# EAGLE board BluePLC B1 MEGA128 -00 (EAGLE 5.03), part 1 of 2
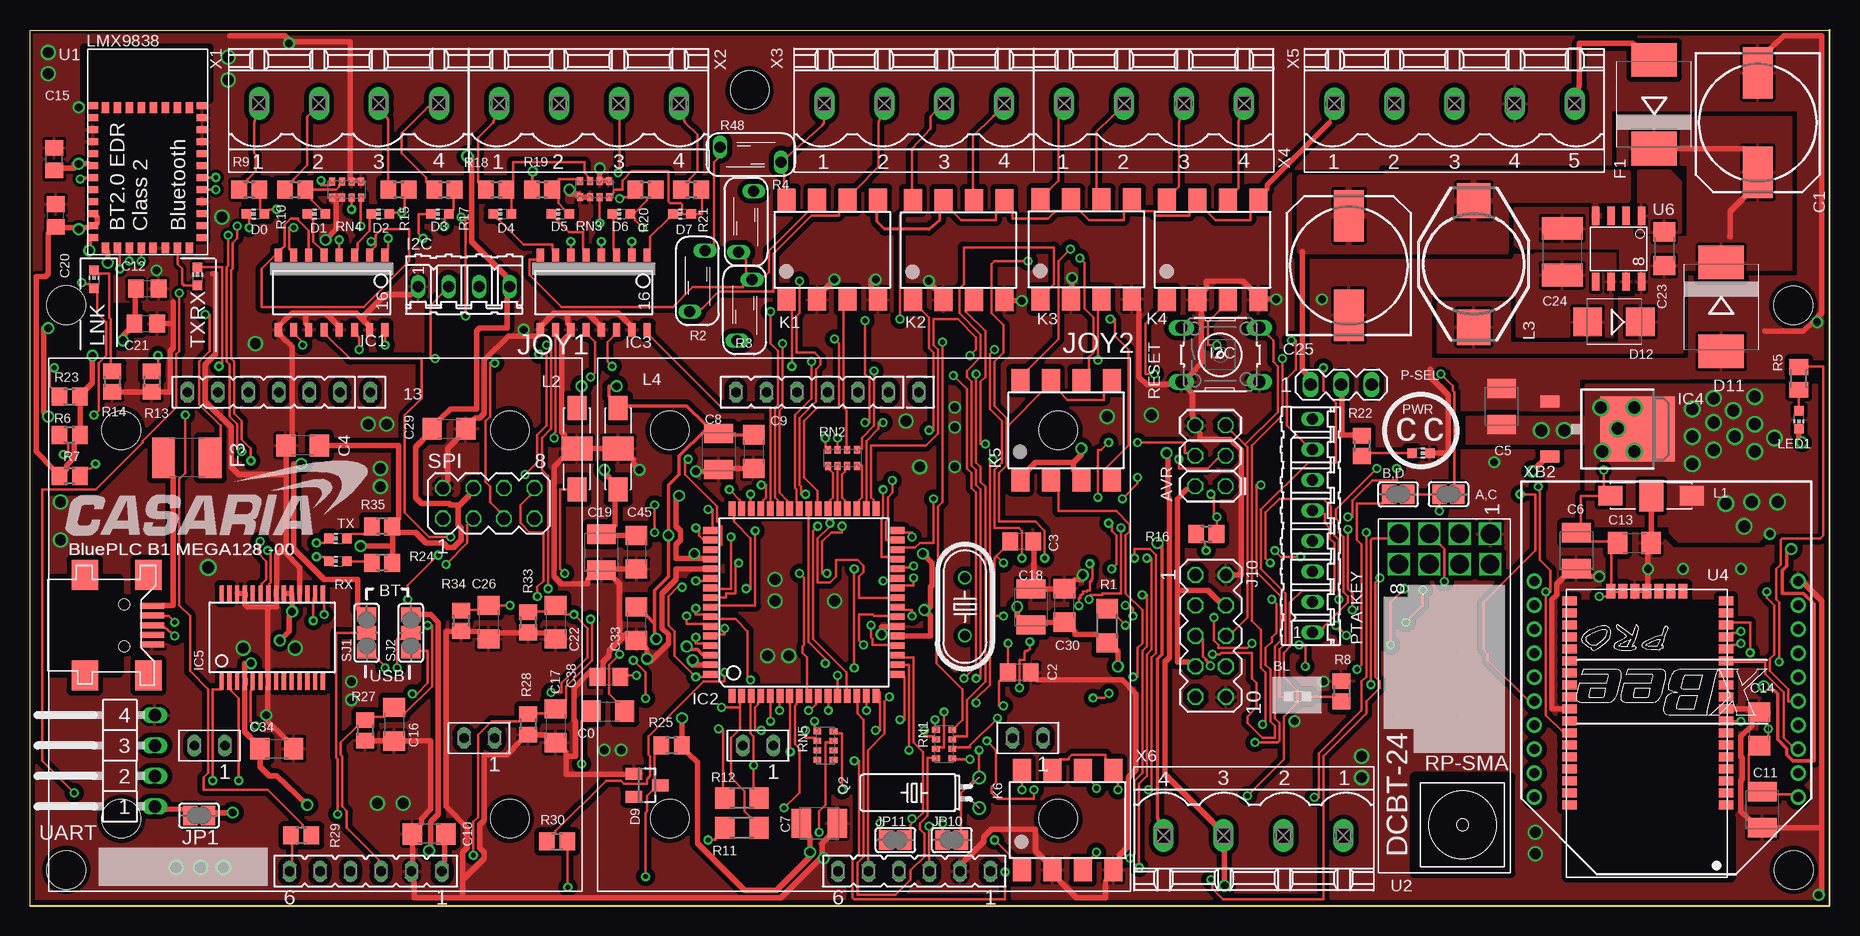
[diagram p4: board, top side]
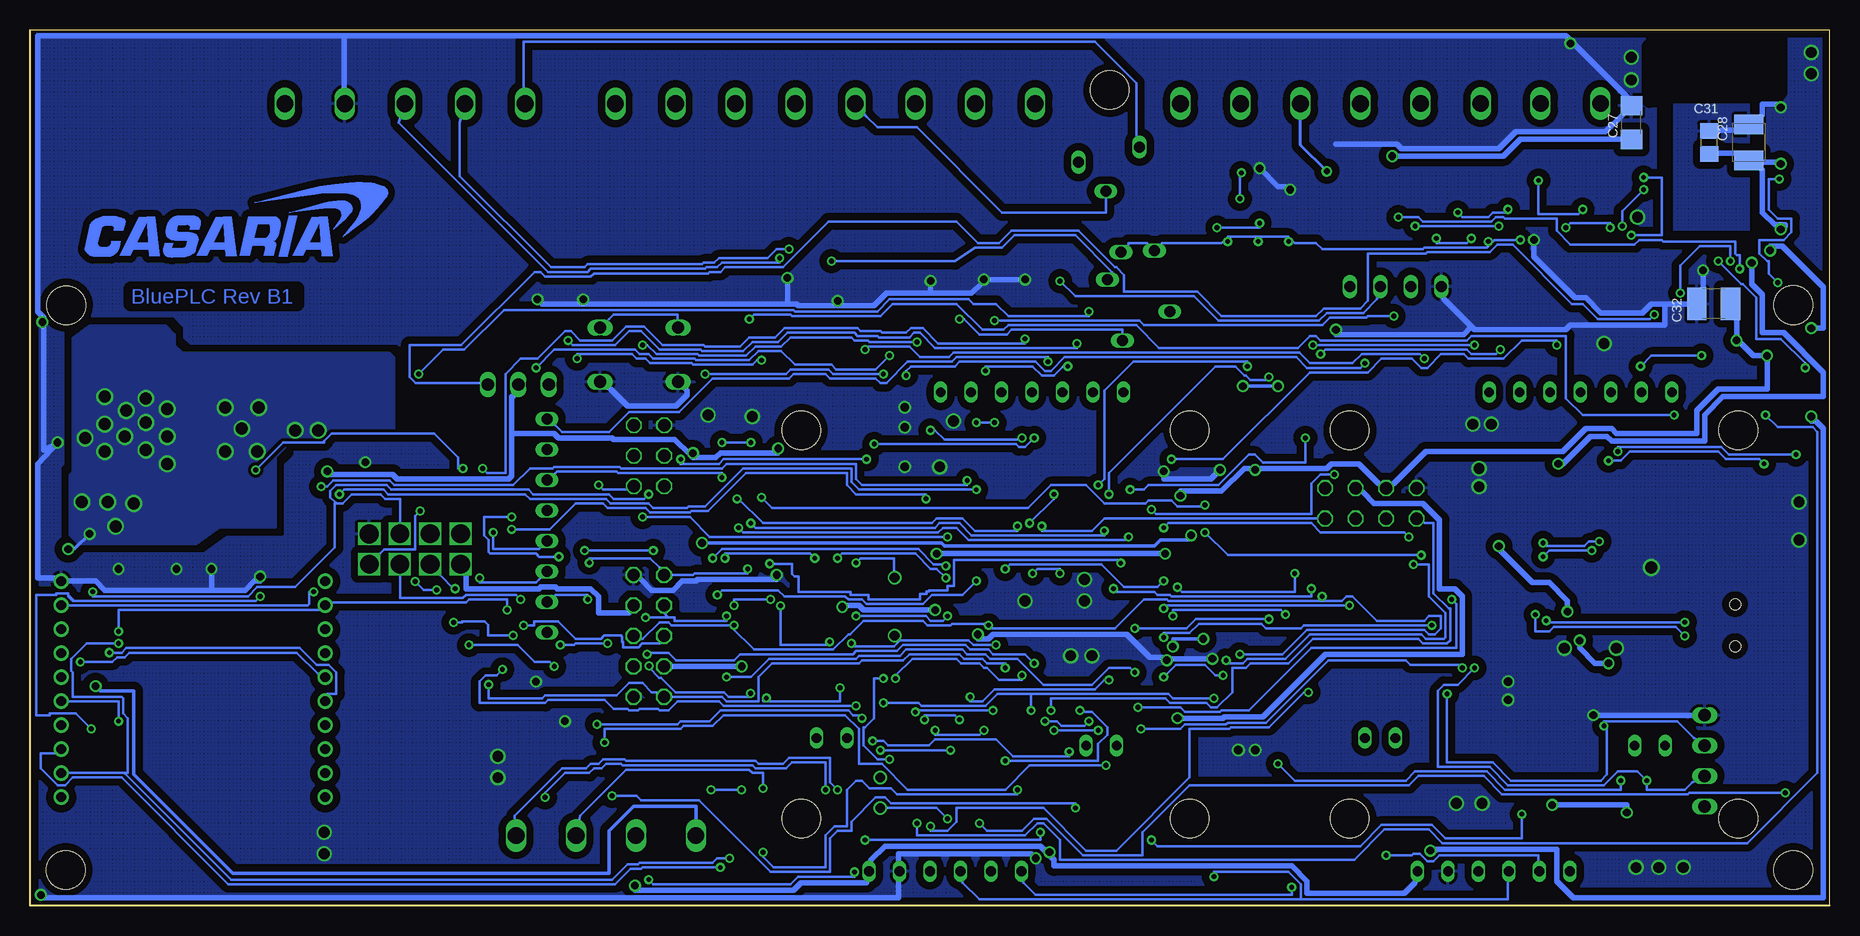
[diagram p5: board, bottom side, seen from below]

Size 150 x 73 mm. Coordinates in mm from the lower left corner, seen from the top.
Outline: 0,0 0,73 150,73 150,0 0,0
Copper layers (1*16): Top 0.035mm / dielectric 1.5mm / Bottom 0.035mm
Design rules "default *": minimum track width 7mil, minimum drill 0.4mm, track to track 7mil, track to pad 7mil, pad to pad 8mil, via to via 8mil, smd to smd 7mil, copper to edge 10mil, drill to drill 15mil, minimum pad ring 6mil, minimum via ring 7mil, stop-mask expansion 4mil, vias tented up to drill 0mil, thermal gap 10mil
Net classes: 0 default: width 0.203 mm, clearance 0.152 mm; 1 smps: width 0.305 mm, drill 0.635 mm, clearance 0.152 mm; 2 power: width 0.457 mm, drill 0.635 mm, clearance 0.152 mm; 3 gnd: width 0.457 mm, drill 0.635 mm, clearance 0.152 mm
Holes 3.2 mm at 3.02,50.07 3.02,2.97 59.98,67.99 147.02,2.97 146.98,50.04
tRestrict: area 128.1,2.4 to 141.7,25
bRestrict: area 4.2,67.6 to 14.6,72.8

## Footprints (pad centres in the part's own frame; a part is rotated, then mirrored left to right if it is on the bottom)
SJ = smd 1.168 x 1.6: 1 -0.762,0; 2 0.762,0
2X3 = drill 1.016 octagon: 1 0,0; 2 0,2.54; 3 2.54,0; 4 2.54,2.54; 5 5.08,0; 6 5.08,2.54
CHIP-LED0603 = smd 0.8 x 0.8: A 0,-0.75; C 0,0.75
C1206 = smd 1.6 x 1.8: 1 -1.4,0; 2 1.4,0
150CLZ-1010 = smd 4.3 x 2.5: + 4.15,0; - -4.15,0
C0805 = smd 1.3 x 1.5: 1 -0.95,0; 2 0.95,0
SMC_B = smd 1.6 x 2.4: + -1.5,0; - 1.5,0
C1812 = smd 1.9 x 3.4: 1 -1.95,0; 2 1.95,0
C1210 = smd 1.6 x 2.7: 1 -1.4,0; 2 1.4,0
SOT23 = smd 1 x 1.4: 1 -0.95,-1.1; 2 0.95,-1.1; 3 0,1.1
SMC = smd 2.8 x 3.8: A 3.7,0; C -3.7,0
SMB = smd 2.4 x 2.4: A 2.2,0; C -2.2,0
04P = drill 0.914 long: 1 -3.81,0; 2 -1.27,0; 3 1.27,0; 4 3.81,0
SO16-OC = smd 0.6 x 1.1: 1 -4.445,-3.175; 2 -3.175,-3.175; 3 -1.905,-3.175; 4 -0.635,-3.175; 5 0.635,-3.175; 6 1.905,-3.175; 7 3.175,-3.175; 8 4.445,-3.175; 9 4.445,3.048; 10 3.175,3.048; 11 1.905,3.048; 12 0.635,3.048; 13 -0.635,3.048; 14 -1.905,3.048; 15 -3.175,3.048; 16 -4.445,3.048
TQFP64 = smd 1.194 x 0.559: 1 -7.8,6; 2 -7.8,5.2; 3 -7.8,4.4; 4 -7.8,3.6; 5 -7.8,2.8; 6 -7.8,2; 7 -7.8,1.2; 8 -7.8,0.4; 9 -7.8,-0.4; 10 -7.8,-1.2; 11 -7.8,-2; 12 -7.8,-2.8; 13 -7.8,-3.6; 14 -7.8,-4.4; 15 -7.8,-5.2; 16 -7.8,-6; 33 7.8,-6; 34 7.8,-5.2; 35 7.8,-4.4; 36 7.8,-3.6; 37 7.8,-2.8; 38 7.8,-2; 39 7.8,-1.2; 40 7.8,-0.4; 41 7.8,0.4; 42 7.8,1.2; 43 7.8,2; 44 7.8,2.8; 45 7.8,3.6; 46 7.8,4.4; 47 7.8,5.2; 48 7.8,6 | smd 0.559 x 1.194: 17 -6,-7.8; 18 -5.2,-7.8; 19 -4.4,-7.8; 20 -3.6,-7.8; 21 -2.8,-7.8; 22 -2,-7.8; 23 -1.2,-7.8; 24 -0.4,-7.8; 25 0.4,-7.8; 26 1.2,-7.8; 27 2,-7.8; 28 2.8,-7.8; 29 3.6,-7.8; 30 4.4,-7.8; 31 5.2,-7.8; 32 6,-7.8; 49 6,7.8; 50 5.2,7.8; 51 4.4,7.8; 52 3.6,7.8; 53 2.8,7.8; 54 2,7.8; 55 1.2,7.8; 56 0.4,7.8; 57 -0.4,7.8; 58 -1.2,7.8; 59 -2,7.8; 60 -2.8,7.8; 61 -3.6,7.8; 62 -4.4,7.8; 63 -5.2,7.8; 64 -6,7.8
DPACK = smd 1 x 1.6: 1 -2.28,-4.8; 3 2.28,-4.8 | smd 5.4 x 6.2: 2 0,2.5
SSOP28DB = smd 0.348 x 1.397: 1 -4.225,-3.656; 2 -3.575,-3.656; 3 -2.925,-3.656; 4 -2.275,-3.656; 5 -1.625,-3.656; 6 -0.975,-3.656; 7 -0.325,-3.656; 8 0.325,-3.656; 9 0.975,-3.656; 10 1.625,-3.656; 11 2.275,-3.656; 12 2.925,-3.656; 13 3.575,-3.656; 14 4.225,-3.656; 15 4.225,3.656; 16 3.575,3.656; 17 2.925,3.656; 18 2.275,3.656; 19 1.625,3.656; 20 0.975,3.656; 21 0.325,3.656; 22 -0.325,3.656; 23 -0.975,3.656; 24 -1.625,3.656; 25 -2.275,3.656; 26 -2.925,3.656; 27 -3.575,3.656; 28 -4.225,3.656
MA05-2 = drill 1.016 octagon: 1 -5.08,-1.27; 2 -5.08,1.27; 3 -2.54,-1.27; 4 -2.54,1.27; 5 0,-1.27; 6 0,1.27; 7 2.54,-1.27; 8 2.54,1.27; 9 5.08,-1.27; 10 5.08,1.27
CTI_JOY = drill 0.813 long: 1 10.541,-20.574; 2 8.001,-20.574; 3 5.461,-20.574; 4 2.921,-20.574; 5 0.381,-20.574; 6 -2.159,-20.574; 7 14.922,-9.461; 8 12.383,-9.461; 9 -7.556,-10.097; 10 -10.097,-10.097; 11 -10.668,19.367; 12 -8.128,19.367; 13 -5.588,19.367; 14 -3.048,19.367; 15 -0.508,19.367; 16 2.032,19.367; 17 4.572,19.367 | hole 3.2: -16.192,16.192; 16.192,16.192; 16.192,-16.192; -16.192,-16.192
DIL08SMD = smd 1.5 x 1.9: 1 -3.81,-4.15; 2 -1.27,-4.15; 3 1.27,-4.15; 4 3.81,-4.15; 5 3.81,4.15; 6 1.27,4.15; 7 -1.27,4.15; 8 -3.81,4.15
NFE61P = smd 2 x 1.6: 1 -3.4,0; 3 3.4,0 | smd 2 x 2.6: 2 0,0
DO3316P = smd 2.92 x 2.79: 1 -5.28,0; 2 5.28,0
MA03-1 = drill 1.016 long: 1 -2.54,0; 2 0,0; 3 2.54,0
08P = drill 0.914 long: 1 -8.89,0; 2 -6.35,0; 3 -3.81,0; 4 -1.27,0; 5 1.27,0; 6 3.81,0; 7 6.35,0; 8 8.89,0
HC49U-V = drill 0.813 round: 1 -2.413,0; 2 2.413,0
TC38H = drill 0.813 round: 1 -1.27,0; 2 1.27,0
R1206 = smd 1.6 x 1.803: 1 -1.422,0; 2 1.422,0
S05K11 = drill 0.914 long: 1 -0.635,-2.54; 2 0.635,2.54
M0805 = smd 1.3 x 1.6: 1 -0.95,0; 2 0.95,0
R0805 = smd 1.3 x 1.5: 1 -0.85,0; 2 0.85,0
B3F-10XX = drill 1.016 long: 1 -3.251,2.261; 2 3.251,2.261; 3 -3.251,-2.261; 4 3.251,-2.261
CAT16 = smd 0.5 x 0.65: 1 -1.2,-0.675; 2 -0.4,-0.675; 3 0.4,-0.675; 4 1.2,-0.675; 5 1.2,0.675; 6 0.4,0.675; 7 -0.4,0.675; 8 -1.2,0.675
SJ_2 = smd 1.168 x 1.6: 1 -1.524,0; 2 0,0; 3 1.524,0
MA04-2 = drill 1.016 octagon: 1 -3.81,-1.27; 2 -3.81,1.27; 3 -1.27,-1.27; 4 -1.27,1.27; 5 1.27,-1.27; 6 1.27,1.27; 7 3.81,-1.27; 8 3.81,1.27
LMX9838 = smd 0.9 x 0.6: 1 -4.55,6; 2 -4.55,5; 3 -4.55,4; 4 -4.55,3; 5 -4.55,2; 6 -4.55,1; 7 -4.55,0; 8 -4.55,-1; 9 -4.55,-2; 10 -4.55,-3; 11 -4.55,-4; 12 -4.55,-5; 21 4.55,-5; 22 4.55,-4; 23 4.55,-3; 24 4.55,-2; 25 4.55,-1; 26 4.55,0; 27 4.55,1; 28 4.55,2; 29 4.55,3; 30 4.55,4; 31 4.55,5; 32 4.55,6 | smd 0.6 x 0.9: 13 -3.5,-5.85; 14 -2.5,-5.85; 15 -1.5,-5.85; 16 -0.5,-5.85; 17 0.45,-5.85; 18 1.5,-5.85; 19 2.5,-5.85; 20 3.5,-5.85; 33 3.5,5.85; 34 2.5,5.85; 35 1.5,5.85; 36 0.5,5.85; 37 -0.5,5.85; 38 -1.5,5.85; 39 -2.5,5.85; 40 -3.5,5.85
DCB-24B-MILLMAX0295 = drill 1.575 pad 1.778 square: 1 1.23,9.31 | drill 1.549 pad 1.778 square: 2 3.77,9.31; 3 1.23,6.77; 4 3.77,6.77; 5 1.23,4.23; 6 3.77,4.23; 7 1.23,1.69; 8 3.77,1.69
ZDM-A2 = smd 0.75 x 1.2: P$1 8.55,6.6; P$2 7.55,6.6; P$3 6.55,6.6; P$4 5.55,6.6; P$5 4.55,6.6; P$6 3.55,6.6; P$7 2.55,6.6; P$8 1.55,6.6; P$9 0.55,6.6; P$10 -0.45,6.6; P$11 -1.45,6.6; P$12 -2.45,6.6; P$13 -3.45,6.6; P$14 -4.45,6.6; P$15 -5.45,6.6; P$16 -6.45,6.6; P$17 -7.45,6.6; P$18 -8.45,6.6; P$26 -8.45,-6.45; P$27 -7.45,-6.45; P$28 -6.45,-6.45; P$29 -5.45,-6.45; P$30 -4.45,-6.45; P$31 -3.45,-6.45; P$32 -2.45,-6.45; P$33 -1.45,-6.45; P$34 -0.45,-6.45; P$35 0.55,-6.45; P$36 1.55,-6.45; P$37 2.55,-6.45; P$38 3.55,-6.45; P$39 4.55,-6.45; P$40 5.55,-6.45; P$41 6.55,-6.45; P$42 7.55,-6.45; P$43 8.55,-6.45 | smd 1.2 x 0.75: P$19 -9.25,3; P$20 -9.25,2; P$21 -9.25,1; P$22 -9.25,0; P$23 -9.25,-1; P$24 -9.25,-2; P$25 -9.25,-3
SO8 = smd 0.61 x 1.524: 1 -1.27,-2.743; 2 0,-2.743; 3 1.27,-2.743; 4 2.54,-2.743; 5 2.54,2.743; 6 1.27,2.743; 7 0,2.743; 8 -1.27,2.743
MA04-1W = drill 1.016 long: 1 -8.89,0; 2 -6.35,0; 3 -3.81,0; 4 -1.27,0
UX60A-MB-5SY = smd 0.5 x 2: 1:VBUS -1.6,2.3; 2:D- -0.8,2.3; 3:D+ 0,2.3; 4:ID 0.8,2.3; 5:GND 1.6,2.3 | smd 2.5 x 2.2: C1 -4.2,2; C2 -4.2,-3.3; C3 4.2,-3.3; C4 4.2,2 | hole 0.9: -1.75,0; 1.75,0
MSTB2.5-4 = drill 1.397 long: 1 -15.001,0; 2 -9.999,0; 3 -5.008,0; 4 -0.004,0
MSTB2.5-5 = drill 1.397 long: 1 -12.501,0; 2 -7.497,0; 3 -2.493,0; 4 2.511,0; 5 7.515,0
XBEE-PRO = drill 0.8 pad 1.27 round: 1 -11,9; 2 -11,7; 3 -11,5; 4 -11,3; 5 -11,1; 6 -11,-1; 7 -11,-3; 8 -11,-5; 9 -11,-7; 10 -11,-9; 11 11,-9; 12 11,-7; 13 11,-5; 14 11,-3; 15 11,-1; 16 11,1; 17 11,3; 18 11,5; 19 11,7; 20 11,9

## Placement (x,y rotation side)
A,C  [SJ]  118.24,34.29 180 top
AVR  AVRSPIPRG  [2X3]  99.67,34.96 90 top
B,D  [SJ]  114.05,34.29 0 top
BL  gn  [CHIP-LED0603]  105.67,17.42 270 top
C0  100n  [C1206]  48.17,16.19 0 top
C1  100uF/35V  [150CLZ-1010]  144.02,65.28 270 top
C2  22pf  [C0805]  82.47,19.42 180 top
C3  22pf  [C0805]  82.66,30.34 180 top
C4  100n  [C1206]  22.73,38.35 180 top
C5  10u tant  [SMC_B]  122.66,41.61 90 top
C6  1u  [SMC_B]  128.91,29.59 270 top
C7  4u7 Tant  [SMC_B]  65.79,6.86 0 top
C8  4u7 Tant  [SMC_B]  57.4,37.85 270 top
C9  100n  [C1206]  60.33,37.85 270 top
C10  100n  [C1206]  33.27,5.97 180 top
C11  4u7 Tant  [SMC_B]  144.4,8 270 top
C12  100n  [C0805]  9.78,51.44 0 top
C13  100n  [C1206]  133.73,30.23 0 top
C14  100n  [C1206]  144.15,14.73 90 top
C15  100n  [C0805]  2.03,62.23 90 top
C16  100n  [C1206]  30.35,15.11 270 top
C17  100n  [C1206]  43.81,14.99 270 top
C18  4u7 tant  [SMC_B]  83.44,24.89 90 top
C19  4u7 Tant  [SMC_B]  47.62,29.46 270 top
C20  2u2  [C0805]  2.16,57.53 90 top
C21  2u2  [C0805]  9.65,48.51 0 top
C22  100n  [C1206]  43.81,23.62 270 top
C23  0.01uF  [C1206]  136.23,54.76 270 top
C24  2u2/50V  [C1812]  127.72,54.51 270 top
C25  100uF/35V  [150CLZ-1010]  109.94,53.36 90 top
C26  100n  [C1206]  38.23,23.62 270 top
C27  100n  [C1206]  16.51,65.28 90 bottom
C28  4u7 tant  [SMC_B]  6.73,63.63 90 bottom
C29  100n  [C1206]  34.92,39.75 0 top
C30  100n  [C1206]  86.23,25.02 90 top
C31  100n  [C0805]  10.03,63.63 90 bottom
C32  2u2  [C1210]  9.65,50.16 180 bottom
C33  100n  [C1206]  50.55,23.5 270 top
C34  100n  [C1206]  20.57,13.08 0 top
C38  10n  [C0805]  48.26,19.05 180 top
C45  100n  [C1206]  50.55,29.46 270 top
D0  or  [CHIP-LED0603]  18.8,57.66 90 top
D1  or  [CHIP-LED0603]  23.88,57.66 90 top
D2  or  [CHIP-LED0603]  29.21,57.66 90 top
D3  or  [CHIP-LED0603]  34.16,57.66 90 top
D4  or  [CHIP-LED0603]  39.37,57.66 90 top
D5  or  [CHIP-LED0603]  44.2,57.66 90 top
D6  or  [CHIP-LED0603]  49.28,57.66 90 top
D7  or  [CHIP-LED0603]  54.36,57.66 90 top
D9  LM4040CYM3-2.5  [SOT23]  51.44,10.03 270 top
D11  1SMC28  [SMC]  140.97,49.91 270 top
D12  B160B  [SMB]  132.04,48.66 180 top
F1  X050  [SMC]  135.38,66.8 90 top
F3  PTC1812  [C1812]  13.08,37.34 180 top
I2C  [04P]  36.18,51.6 0 top
IC1  PC3Q64  [SO16-OC]  25.15,51.05 180 top
IC2  ATMEGA128-A  [TQFP64]  64.52,25.27 90 top
IC3  PC3Q64  [SO16-OC]  46.99,51.05 180 top
IC4  MC33269D-3.3  [DPACK]  131.49,39.73 270 top
IC5  FT232RL  [SSOP28DB]  20.19,22.35 0 top
J10  JTAG/GPIO  [MA05-2]  98.42,22.48 270 top
JOY1  F1XXX-N63  [CTI_JOY]  23.8,23.43 0 top
JOY2  F1XXX-N63  [CTI_JOY]  69.52,23.43 0 top
JP1  [SJ]  14.1,7.49 180 top
JP10  [SJ]  76.83,5.46 0 top
JP11  [SJ]  72.14,5.46 0 top
K1  AQW210EH654SMD  [DIL08SMD]  66.89,54.69 0 top
K2  AQW210EH654SMD  [DIL08SMD]  77.4,54.65 0 top
K3  AQW210EH654SMD  [DIL08SMD]  88.05,54.7 0 top
K4  AQW210EH654SMD  [DIL08SMD]  98.58,54.68 0 top
K5  AQW210EH654SMD  [DIL08SMD]  86.36,39.62 0 top
K6  AQW210EH654SMD  [DIL08SMD]  86.49,7.11 0 top
L1  NTE61P  [NFE61P]  135.13,34.16 180 top
L2  NTE61P  [NFE61P]  45.59,38.1 270 top
L3  DO3316P-154  [DO3316P]  120.35,53.49 90 top
L4  NTE61P  [NFE61P]  49.02,38.1 270 top
LED1  bl  [CHIP-LED0603]  147.45,40.51 180 top
LNK  bl  [CHIP-LED0603]  5.33,52.2 0 top
P-SEL  [MA03-1]  109.29,43.43 0 top
PTA-KEY  [08P]  106.91,31.65 90 top
PWR  bl  [CHIP-LED0603]  115.95,37.72 270 top
Q1  16Mhz  [HC49U-V]  77.93,24.91 270 top
Q2  32768KHz  [TC38H]  79.12,9.4 90 top
R1  10k  [R1206]  89.78,23.32 270 top
R2  ROV05-201K  [S05K11]  55.63,52.07 180 top
R3  ROV05-201K  [S05K11]  59.56,49.66 180 top
R4  ROV05-201K  [S05K11]  59.69,57.02 0 top
R5  400  [M0805]  147.45,43.94 270 top
R6  1K  [R0805]  3.3,39.24 0 top
R7  DNP  [R0805]  3.3,35.81 180 top
R8  330R  [R0805]  109.33,17.88 270 top
R9  3K9  [R0805]  18.29,59.69 0 top
R10  3K9  [R0805]  22.1,59.69 0 top
R11  1K  [R1206]  59.34,6.48 0 top
R12  1K  [R1206]  59.34,8.95 0 top
R13  330R  [R0805]  10.16,43.69 270 top
R14  330R  [R0805]  6.86,43.69 270 top
R15  3K9  [R0805]  30.73,59.69 0 top
R16  1K  [R0805]  98.04,30.99 0 top
R17  3K9  [R0805]  34.54,59.69 0 top
R18  3K9  [R0805]  38.86,59.69 0 top
R19  3K9  [R0805]  42.67,59.69 0 top
R20  3K9  [R0805]  51.31,59.69 0 top
R21  3K9  [R0805]  55.12,59.69 0 top
R22  560R  [R0805]  111.01,38.33 270 top
R23  1K  [R0805]  3.3,42.42 0 top
R24  330R  [R0805]  29.34,28.57 180 top
R25  1K8  [R0805]  53.47,13.34 180 top
R27  1K8  [R0805]  27.94,14.61 270 top
R28  1K8  [R0805]  41.53,15.11 270 top
R29  1K2  [R0805]  22.61,5.84 180 top
R30  1K2  [R0805]  43.94,5.33 0 top
R33  1K8  [R0805]  41.53,23.62 270 top
R34  1K8  [R0805]  35.94,23.75 270 top
R35  330R  [R0805]  29.34,31.62 180 top
R48  ROV05-201K  [S05K11]  60.07,62.61 270 top
RESET  [B3F-10XX]  99.23,45.93 0 top
RN1  390R  [CAT16]  76.2,13.46 270 top
RN2  390R  [CAT16]  67.72,37.33 0 top
RN3  3K3  [CAT16]  47.07,59.73 180 top
RN4  3K3  [CAT16]  26.4,59.69 180 top
RN5  390R  [CAT16]  66.29,13.34 270 top
RX  [CHIP-LED0603]  25.65,28.7 90 top
SJ1  [SJ_2]  28.07,22.73 90 top
SJ2  [SJ_2]  31.75,22.73 90 top
SPI  [MA04-2]  38.23,33.53 0 top
TX  [CHIP-LED0603]  25.65,30.61 90 top
TXRX  gn  [CHIP-LED0603]  13.97,52.45 0 top
U1  LMX9838  [LMX9838]  9.8,60.68 0 top
U2  dcbt-24b  [DCB-24B-MILLMAX0295]  112.41,32.22 270 top
U4  ZDM-A1281-A2  [ZDM-A2]  134.78,16.95 270 top
U6  LM2672M-5.0  [SO8]  133.05,54.76 180 top
U$3  [CC-LOGO]  116.84,40.23 0 top
U$9  CASARIA_LOGO_COPPER  [CASARIA_LOGO_COPPER]  134.37,55.12 0 bottom
U$10  CASARIA_LOGO_TPLACE  [CASARIA_LOGO]  12.7,31.88 0 top
UART  [MA04-1W]  10.41,17.14 90 top
USB  UX60-MB-5ST  [UX60A-MB-5SY]  7.87,23.37 270 top
X1  MSTB2.5-4  [MSTB2.5-4]  34.09,66.87 0 top
X2  MSTB2.5-4  [MSTB2.5-4]  54.1,66.86 0 top
X3  MSTB2.5-4  [MSTB2.5-4]  81.21,66.86 0 top
X4  MSTB2.5-4  [MSTB2.5-4]  101.2,66.86 0 top
X5  MSTB2.5-5  [MSTB2.5-5]  121.24,66.86 0 top
X6  MSTB2.5-4  [MSTB2.5-4]  94.49,5.84 180 top
XB2  XBEE-PRO  [XBEE-PRO]  136.4,18.03 180 top

## Tracks (layer width: path | path; a pad name or v marks a point on that pad's centre or on a via)
3V3-ZIG  (via drill 0.4)
  Top 0.203: U4.P$25 132.08,26.16 132.46,26.16 U4.P$24 | U4.P$25 131.83,26.67 131.83,29.34 C13.1 131.57,30.35 130.05,30.35 C6.+ 129.29,31.88 129.29,34.16 L1.3 131.19,34.92 v131.19,36.32 | XB2.1 146.81,9.27 145.54,9.27 C11.+ 143.26,10.29 143.26,12.57 C14.1 144.91,14.1 v144.91,14.73 | v98.04,29.59 98.04,29.72 97.92,29.72 97.92,30.35 97.79,30.35 R16.1 | v103.76,29.59 104.27,29.08 v105.92,29.08 | v109.86,32.38 110.24,32.38 110.24,33.78 111.89,35.43 113.92,35.43 v113.92,36.45 | v130.81,25.78 131.44,25.78 U4.P$25
  Bottom 0.203: v98.04,29.59 v103.76,29.59 | v105.92,29.08 107.57,29.08 107.82,29.34 111.63,29.34 111.76,29.46 111.76,30.48 112.14,30.86 112.14,32.38 v109.86,32.38 | v113.92,36.45 114.3,36.45 114.3,37.34 116.33,39.37 124.84,39.37 125.48,38.73 125.48,38.61 128.91,38.61 v131.19,36.32 | v144.91,14.73 146.18,16 148.34,16 148.34,15.88 149.48,15.88 149.48,25.91 147.83,25.91 147.83,26.04 146.81,26.04 146.81,25.78 146.69,25.78 146.69,25.65 146.56,25.65 146.56,25.53 146.43,25.53 146.43,25.4 131.19,25.4 v130.81,25.78
5VREG
  Top 0.457: P-SEL.1 106.3,44.45 106.05,44.7 106.05,54.51
  pour Top (isolate 0.254): 130.77,56.79 130.38,56.79 130.38,58.82 123.02,58.82 123.02,54.51 105.87,54.51 105.87,60.73 113.11,60.73 113.11,61.11 133.18,61.11 133.18,58.82 130.77,58.82
!RESET  (via drill 0.4)
  Top 0.203: v70.1,23.37 70.1,22.35 70.23,22.23 70.23,21.72 71.75,21.72 IC2.20 | v49.15,20.95 48.26,20.07 48.26,17.65 48.9,17.02 C0.2 | v91.31,23.37 90.68,24 R1.1 | v42.29,25.78 42.29,26.54 42.8,27.05 42.8,31.11 41.66,31.11 40.89,31.88 40.89,33.4 41.66,34.16 SPI.8 | 101.28,38.42 101.47,38.23 101.47,24 100.33,22.86 J10.6 | 101.28,38.42 100.2,39.5 AVR.5 | RESET.2 103.25,47.5 103.63,47.12 103.63,45.34 104.01,44.96 104.01,41.15 101.28,38.42
  Bottom 0.203: RESET.1 96.01,48.9 96.01,49.28 101.35,49.28 101.73,48.9 RESET.2 | 91.5,23.18 91.69,23.37 96.52,23.37 96.77,23.62 97.54,23.62 98.93,22.23 99.06,22.23 J10.6 | 91.5,23.18 89.66,21.34 83.06,21.34 81.79,22.61 81.66,22.61 80.52,23.75 75.56,23.75 75.18,23.37 73.28,23.37 73.15,23.5 70.23,23.5 v70.1,23.37 69.85,23.11 59.56,23.11 57.15,25.53 55.24,25.53 55.12,25.4 42.29,25.4 | v49.15,20.95 45.59,20.95 43.56,22.99 33.78,22.99 33.4,22.61 32.89,22.61 32.38,23.11 32.38,24.13 33.4,24.13 33.78,23.75 37.72,23.75 39.75,25.78 40.26,25.78 40.64,25.4 42.29,25.4 | 91.5,23.18 v91.31,23.37 | 42.29,25.4 v42.29,25.78
!RESET_ZIG  (via drill 0.4)
  Top 0.203: v142.62,15.37 141.86,15.37 U4.P$8 | v73.53,30.73 73.53,31.11 72.9,31.11 IC2.32 | R16.2 98.93,31.62 v98.93,32.38 98.68,32.64 98.68,34.04 v98.42,34.29 | v144.78,26.16 144.78,25.65 145.41,25.02 145.41,20.95 145.03,20.57 145.03,19.56 146.56,18.03 146.56,17.02 146.81,17.02 XB2.5
  Bottom 0.203: v142.62,15.37 142.62,17.02 146.81,17.02 XB2.5 | v73.53,30.73 93.34,30.73 95,32.38 v98.93,32.38 | 124.52,33.59 124.97,34.04 124.97,34.54 124.46,35.05 120.27,35.05 119.89,34.67 108.46,34.67 108.08,34.29 101.73,34.29 101.35,33.91 98.81,33.91 v98.42,34.29 | 124.52,33.59 124.46,33.53 123.95,33.53 123.19,34.29 120.78,34.29 120.4,33.91 119.13,33.91 119.13,31.75 U2.3 | v144.78,26.16 144.78,25.78 131.83,25.78 131.06,26.54 127.89,26.54 124.59,29.84 124.59,33.53 124.52,33.59
+3V3  (via drill 0.64)
  Top 0.457: IC5.20 21.34,26.04 21.72,26.04 IC5.19 21.84,25.4 v21.84,24.51 21.59,24.13 21.59,22.86 v20.83,22.1 | U1.10 5.59,57.4 5.59,56.9 U1.11 4.83,56.52 4.06,56.52 | 4.06,56.52 2.79,56.52 C20.1 1.52,56.01 1.52,52.7 1.27,52.45 0.51,52.45 0.51,37.85 1.91,36.45 R7.2 3.05,36.45 3.05,36.7 3.68,37.34 3.68,38.61 R6.2 4.19,39.88 4.19,41.78 R23.2 4.7,43.05 5.21,43.56 v5.21,45.85 | U1.6 4.83,61.85 v4.06,61.85 3.68,61.85 3.68,61.47 2.67,61.47 C15.1 | 4.06,56.52 v4.06,56.39 | C12.1 8.76,50.8 8.76,49.15 C21.1 8.13,47.88 7.75,47.5 v7.75,47.12 | v82.3,24.89 82.3,24.13 C18.+ 84.58,23.62 85.34,23.62 C30.1 87.12,22.86 87.12,22.61 88.9,22.61 R1.2 90.68,21.21 v90.68,19.94 | IC2.21 72.9,22.48 75.06,22.48 75.06,24.13 v74.55,24.64 74.93,24.89 75.06,24.89 75.06,26.54 75.18,26.67 75.18,28.57 v74.42,29.34 | 95.63,26.29 95.63,33.91 96.39,34.67 AVR.2 | 95.63,26.29 95.63,20.32 96.52,20.32 J10.7 | J10.4 99.06,25.4 98.17,26.29 95.63,26.29 | 30.23,29.97 30.23,30.99 R35.1 | 30.23,29.97 30.23,29.21 R24.1 | C4.1 30.73,38.35 30.73,32.26 R35.1 | C45.1 49.66,30.86 48.77,30.86 C19.+ 48.77,31.75 48.77,33.78 L4.3 48.26,35.69 47.88,36.07 v47.88,36.32 | 55.37,28.96 53.85,28.96 53.85,30.1 54.23,30.48 54.23,31.24 53.85,31.62 53.85,33.91 v54.1,34.16 | 55.37,28.96 56.13,28.96 IC2.52 | 35.69,33.27 35.69,31.75 35.94,31.5 35.94,30.48 35.31,29.84 34.8,29.84 34.42,30.23 33.02,30.23 32.13,31.11 30.73,31.11 R35.1 | 35.69,33.27 36.58,34.16 SPI.4 | v36.45,62.48 36.83,62.48 36.83,55.37 39.62,52.58 I2C.4 39.75,50.55 39.75,48.13 37.47,48.13 37.21,47.88 37.21,41.4 35.05,41.4 34.29,40.64 C29.1 32.77,38.86 32.13,38.23 32.13,34.04 32.64,33.53 34.92,33.53 35.05,33.4 35.56,33.4 35.69,33.27
  Top 0.457: 55.37,28.96 v55.37,29.34 | v27.56,29.97 30.23,29.97 | v16.89,7.75 15.37,7.75 JP1.1 | v23.11,8.38 20.57,10.79 19.94,10.79 19.18,11.56 C34.1 18.41,13.97 17.91,14.48 17.91,18.03 IC5.4 17.91,19.3 17.91,20.19 v18.41,20.19
  Bottom 0.457: C31.1 9.4,62.74 7.87,62.74 C28.+ | v4.06,61.85 3.94,61.85 3.94,61.98 5.59,61.98 C28.+ | v4.06,56.39 3.94,56.39 3.68,56.64 3.68,56.77 4.57,56.77 5.59,57.78 5.59,61.34 C28.+ | C32.1 7.75,48.9 v7.75,47.12 7.37,46.86 6.35,45.85 v5.21,45.85 5.21,43.05 9.27,43.05 11.05,41.27 11.05,39.37 17.78,39.37 18.16,39.75 20.32,39.75 22.23,37.85 33.66,37.85 36.32,35.18 SPI.4 37.59,35.18 39.24,36.83 41.53,36.83 41.91,36.45 47.88,36.45 | v74.55,24.64 80.52,24.64 80.9,25.02 82.17,25.02 v82.3,24.89 | U2.8 113.67,27.81 113.67,26.42 107.57,26.42 107.44,26.54 106.17,26.54 106.05,26.42 103.25,26.42 102.62,25.78 102.62,24.38 100.08,24.38 J10.4 | v90.68,19.94 J10.7 | v54.1,34.16 54.1,34.54 50.67,34.54 48.77,36.45 47.88,36.45 | 47.88,36.45 v47.88,36.32 | v36.45,62.48 27.18,62.48 25.78,63.88 17.4,63.88 C27.1 | v55.37,29.34 v74.42,29.34 | v21.84,24.51 21.84,25.4 23.37,26.92 24.77,26.92 27.56,29.72 v27.56,29.97 | v16.89,7.75 16.89,8.38 v23.11,8.38 | v20.83,22.1 20.83,21.46 19.56,20.19 v18.41,20.19
+5V  (via drill 0.64)
  Top 0.457: C7.+ 65.02,5.71 v65.02,4.45 65.02,4.06 62.23,1.27 59.56,1.27 55.63,5.21 55.63,11.94 54.86,12.7 R25.1 54.36,13.97 v54.36,15.62 | 87,36.96 83.82,36.96 83.19,36.32 K5.1 | 87,36.96 87,36.32 K5.3 | R22.1 110.36,39.24 109.35,39.24 109.35,42.29 P-SEL.2 | v125.22,36.2 125.98,36.96 IC4.3 | v87.63,38.1 87.63,37.59 87,36.96 | C10.1 34.54,5.08 34.54,3.81 JOY1.1 | v99.57,1.65 99.57,4.19 X6.3 98.55,6.99 94.61,10.92 94.61,20.32 95,20.7 95,33.91 94.87,34.04 94.87,37.59 v94.74,37.72
  Bottom 0.457: v54.36,15.62 50.55,15.62 50.42,15.75 47.24,15.75 42.04,20.95 30.61,20.95 30.61,25.78 31.24,26.42 32.51,26.42 32.51,32.13 33.91,33.53 37.97,33.53 38.86,34.42 SPI.6 | v125.22,36.2 124.97,35.94 119.76,35.94 119.38,35.56 110.11,35.56 109.86,35.81 109.86,39.37 | 109.86,39.37 109.86,42.42 109.73,42.42 P-SEL.2 | v87.63,38.1 87.63,37.72 92.46,37.72 92.84,37.34 94.74,37.34 95,37.59 | 95,37.59 96.27,38.86 101.35,38.86 101.47,38.99 105.92,38.99 106.3,39.37 109.86,39.37 | 65.15,4.32 64.64,3.81 64.64,3.3 44.83,3.3 43.56,2.03 43.56,1.02 35.43,1.02 34.54,1.91 JOY1.1 | 65.15,4.32 65.79,4.95 78.74,4.95 79.88,3.81 JOY2.1 80.26,1.91 85.72,1.91 86.36,1.27 99.57,1.27 v99.57,1.65 | v94.74,37.72 94.87,37.72 95,37.59 | 65.15,4.32 v65.02,4.45
+24V
  Top 0.457: F1.C 137.16,63.12 142.88,63.12 C1.+ 142.88,59.05 141.73,57.91 141.73,55.75 141.69,55.77
  pour Top (isolate 0.254): 146.81,52.98 133.48,52.96 133.48,51.31 132.59,51.31 132.59,52.98 132.54,52.98 132.54,54.63 132.42,54.76 124.16,54.76 123.78,55.01 123.78,58.19 129.88,58.19 129.88,56.41 133.56,56.41 133.56,55.77 138.18,55.75 138.18,61.72 132.33,61.72 132.33,65.79 146.81,65.79
AREF  (via drill 0.64, 1)
  Top 0.305: v54.74,21.59 54.74,21.34 55.63,21.34 56.01,20.95 56.13,20.95 IC2.62 | v52.2,22.23 52.07,22.35 52.07,23.5 | 52.07,23.5 51.44,24.13 C33.1 | C9.1 59.44,39.24 58.55,39.24 C8.+ | v45.97,43.31 45.97,42.42 L2.1 | v48.9,43.31 48.26,43.31 48.26,42.42 L4.1 49.78,41.66 54.74,41.66 56.26,40.13 C8.+ | 52.07,23.5 52.07,26.29 53.21,27.43 v53.21,30.86 53.21,35.05 54.1,35.94 54.1,37.47 56.26,39.62 C8.+ | v144.53,18.29 145.03,18.29 145.67,17.65 145.67,13.84 146.43,13.08 146.43,12.57 146.94,12.06 148.72,12.06 148.72,25.15 147.83,26.04 146.05,26.04 146.05,27.94 146.43,28.32 146.43,29.72 v146.81,29.72 | v93.98,30.23 94.36,30.23 94.36,20.95 93.98,20.57 93.98,7.37 X6.4
  Bottom 0.305: v54.74,21.59 54.74,22.23 v52.2,22.23 | v48.9,43.31 v45.97,43.31 | v144.53,18.29 144.15,17.91 141.35,17.91 141.35,10.92 133.1,2.67 101.73,2.67 101.73,6.22 99.69,8.26 94.49,8.26 94.49,7.49 X6.4 | v53.21,30.86 53.21,30.48 55.75,30.48 56.26,29.97 73.79,29.97 74.04,30.23 v93.98,30.23 | v145.03,30.99 146.3,29.72 v146.81,29.72
  other vias: 125.98,39.62 127.89,39.62 130.94,41.53 133.73,41.53 132.33,39.75 131.06,37.85 133.73,37.85 138.56,41.4 138.56,39.12 140.34,40.26 140.34,42.29 141.35,33.53 140.34,37.97 141.99,41.27 143.76,42.42 143.76,40.13 143.51,33.66 142.88,31.62 142.11,39.12 143.76,37.85 145.41,38.99 145.67,33.66 138.56,36.83
  pour Top (isolate 0.305, no thermals): 119.76,40.77 129.67,40.77 129.67,43.43 149.1,43.43 149.1,30.99 139.83,30.99 139.83,31.62 129.67,31.62 129.67,38.48 119.76,38.48
  pour Bottom (isolate 0.254, rank 2): 119.63,45.72 119.63,38.61 119.89,38.35 128.52,38.35 129.54,37.34 129.54,35.69 129.54,31.5 134.24,31.5 136.14,30.1 145.92,30.1 146.69,30.86 146.69,35.94 146.43,36.2 146.43,47.37 145.03,48.39 138.68,48.39 137.92,47.62 137.92,46.74 137.29,46.1 120.02,46.1
  pour Top (isolate 0.254): 136.65,35.81 136.65,31.11 137.41,30.35 144.15,30.35 144.65,30.99 144.65,35.81
AVDD  (via drill 0.4)
  Top 0.203: v50.55,19.18 49.78,19.18 C38.1 | IC2.64 56.13,19.05 v55.5,19.05 53.72,20.83 53.72,22.86 53.21,23.37 53.21,25.78 53.98,26.54 v54.36,26.54 | v44.58,27.69 44.2,28.07 44.2,34.67 44.83,34.67 L2.3
  Bottom 0.203: v55.5,19.05 54.48,20.07 52.07,20.07 51.18,19.18 v50.55,19.18 | v44.58,27.69 44.58,26.16 53.98,26.16 v54.36,26.54
BT_CTS  (via drill 0.4)
  Top 0.203: v8.26,53.72 8.26,54.48 U1.15 | v12.45,51.05 12.45,46.23 12.19,45.97 12.19,41.53 9.4,38.73 9.4,38.61 5.46,34.67 1.02,34.67 1.02,12.06 v3.68,9.4 | v70.87,6.86 70.87,6.22 JP11.1
  Bottom 0.203: v8.26,53.72 8.26,54.99 10.79,54.99 12.45,53.34 v12.45,51.05 | v3.68,9.4 11.68,9.4 11.81,9.27 27.3,9.27 28.83,10.79 34.29,10.79 35.05,10.03 53.34,10.03 57.28,6.1 57.28,4.19 62.23,4.19 65.28,7.24 66.29,7.24 67.31,6.22 70.23,6.22 v70.87,6.86
BT_RTS  (via drill 0.4)
  Top 0.203: v7.49,53.09 7.49,54.48 U1.14 | v35.94,57.4 36.32,57.4 v36.32,49.15 | v69.6,48.77 69.6,44.32 69.98,43.94 69.98,40.26 69.85,40.13 69.6,40.13 v69.6,40.26 | v71.12,40.26 70.74,40.26 70.74,39.75 69.72,38.73 69.72,33.66 IC2.34
  Bottom 0.203: v7.49,53.09 7.49,54.23 7.75,54.23 7.87,54.36 7.87,55.37 13.84,55.37 13.97,55.5 15.88,55.5 16.26,55.12 21.59,55.12 22.73,56.26 22.73,57.28 27.05,57.28 27.18,57.4 27.81,57.4 28.19,57.02 33.91,57.02 34.29,57.4 v35.94,57.4 | v36.32,49.15 38.48,49.15 38.61,49.02 41.66,49.02 42.29,48.39 57.15,48.39 57.53,48.77 v69.6,48.77 | v69.6,40.26 v71.12,40.26
BTRXD  (via drill 0.64)
  Top 0.457: v4.95,54.61 4.95,55.5 U1.12 | v1.52,48.13 1.14,48.13 1.14,41.15 v1.52,40.77 | v33.27,4.57 33.4,4.7 33.4,6.99 34.04,7.62 34.04,23.62 33.4,24.26 SJ2.3
  Bottom 0.457: v4.95,54.61 4.95,54.99 3.94,54.99 0.51,51.56 0.51,48.13 v1.52,48.13 | v1.52,40.77 1.52,40.39 1.14,40.39 0.51,39.75 0.51,0.64 21.34,0.64 22.73,2.03 22.73,4.7 32.77,4.7 32.89,4.57 v33.27,4.57
BTTXD  (via drill 0.64)
  Top 0.457: v6.48,53.59 6.48,54.48 U1.13 | v22.61,36.83 21.97,36.83 21.97,29.72 24.51,27.18 27.3,27.18 27.3,24.77 SJ1.3
  Bottom 0.457: v6.48,53.59 6.48,51.82 5.59,50.93 5.59,47.75 3.81,47.75 0.51,44.45 0.51,42.42 8.89,42.42 10.41,40.89 10.41,38.73 18.16,38.73 18.54,39.12 19.94,39.12 22.23,36.83 v22.61,36.83
CKOPT  (via drill 0.4)
  Top 0.203: v69.47,21.72 69.09,22.1 69.09,24.26 70.23,24.26 70.36,24.13 71.75,24.13 IC2.23 | v81.53,21.84 81.53,20.07 C2.2 80.9,18.8 80.77,18.67 80.77,16.64 v81.15,16.64 | v110.62,19.68 111,20.07 111,30.1 110.62,30.48 110.62,33.53 112.78,33.53 B,D.1
  Bottom 0.203: v69.47,21.72 71.37,21.72 71.75,22.1 77.47,22.1 | 77.47,22.1 77.6,22.1 Q1.2 | v81.53,21.84 81.28,21.59 77.98,21.59 77.47,22.1 | v110.62,19.68 111.12,19.18 112.01,19.18 112.52,18.67 112.52,16.89 107.06,16.89 106.81,17.14 102.11,17.14 101.35,16.38 100.2,16.38 100.08,16.26 99.31,16.26 99.19,16.38 97.66,16.38 97.54,16.26 96.77,16.26 96.01,17.02 92.58,17.02 92.2,16.64 v81.15,16.64
COM_IO  (via drill 0.4)
  Top 0.203: X5.1 108.33,65.28 | 103.12,59.69 K4.5 101.73,57.91 101.73,57.15 98.81,57.15 98.04,57.91 K4.7 96.65,57.91 96.65,57.53 93.85,57.53 93.73,57.66 93.73,57.91 92.58,57.91 K3.5 91.19,57.91 91.19,57.15 88.27,57.15 87.5,57.91 K3.7 86.11,57.91 85.34,57.91 85.34,57.78 84.84,57.28 81.92,57.28 81.92,57.91 K2.5 80.52,57.91 80.52,57.15 77.6,57.15 76.83,57.91 K2.7 | K6.7 85.85,12.19 86.61,12.19 86.61,12.32 86.87,12.57 89.66,12.57 89.66,12.19 K6.5 90.68,10.41 v90.68,9.65 | K5.5 89.53,42.93 89.53,42.16 86.49,42.16 85.72,42.93 K5.7 84.45,42.93 81.6,40.07 | v93.22,9.65 93.47,9.65 93.47,20.7 93.85,21.08 93.85,29.21 93.34,29.72 92.08,29.72 v92.08,28.96 | v84.58,28.96 84.58,31.24 83.82,32 80.77,32 80.77,36.07 81.41,36.7 81.41,39.88 81.6,40.07 | IC3.8 42.29,53.85 41.66,53.85 41.66,52.58 44.32,49.91 53.59,49.91 55.24,51.56 59.44,51.56 59.44,51.69 R3.1 | K1.7 64.9,57.91 61.59,54.61 61.59,52.83 61.21,52.45 R3.1 | IC1.6 23.24,56.26 22.35,57.15 22.35,57.28 21.72,57.28 21.21,56.77 21.21,54.99 20.95,54.74 IC1.8 20.45,54.23 19.3,53.09 19.3,49.91 27.81,49.91 31.62,53.72 31.62,56.39 29.34,56.39 28.83,55.88 28.83,55.37 | 28.83,55.37 28.83,54.99 28.57,54.74 IC1.2 | v25.78,55.5 IC1.4 | v45.09,55.37 IC3.6 | v47.62,55.37 IC3.4 | v50.16,55.37 IC3.2 | 28.83,55.37 v28.45,55.37 | R3.1 59.69,52.83 59.69,53.85 R4.1 | v83.19,53.72 80.39,53.72 80.14,53.47 80.14,49.4 81.15,48.39 81.15,46.1 80.39,45.34 80.39,41.66 81.41,40.64 81.41,40.13 81.53,40.13 81.6,40.07 | R48.1 57.28,62.23 57.02,61.98 57.02,55.12 R2.1
  Top 0.254: K1.5 70.48,58.84 70.48,58.8 70.61,58.8 70.61,57.02 71.25,56.39 74.93,56.39 75.82,57.15 75.82,58.49 K2.7
  Top 0.406: 108.33,65.28 103.12,60.07 103.12,59.69
  Bottom 0.203: X5.1 108.84,68.45 108.84,72.01 61.21,72.01 57.78,68.58 57.78,64.26 R48.1 | v93.22,9.65 v90.68,9.65 | v92.08,28.96 92.08,29.34 84.96,29.34 v84.58,28.96 | v25.78,55.5 27.94,55.5 28.26,55.18 | 28.26,55.18 28.57,54.86 33.78,54.86 33.91,54.74 42.29,54.74 42.8,55.24 44.58,55.24 44.9,55.56 | 44.9,55.56 45.09,55.75 47.62,55.75 | 47.62,55.75 50.16,55.75 50.35,55.56 | 50.35,55.56 50.67,55.24 55.63,55.24 R2.1 56.9,55.24 58.42,55.24 58.42,55.12 R4.1 | 44.9,55.56 v45.09,55.37 | 47.62,55.75 v47.62,55.37 | 50.35,55.56 v50.16,55.37 | v28.45,55.37 28.26,55.18 | v83.19,53.72 72.9,53.72 71.25,54.86 68.96,54.86 67.94,55.88 62.87,55.88 59.82,52.83 R3.1
CTS_ZIG  (via drill 0.4)
  Top 0.203: v71.12,34.67 71.12,32.38 70.99,32.26 70.99,29.08 71.75,29.08 IC2.29 | v124.21,34.29 125.48,34.29 125.48,29.59 121.16,25.27 121.16,21.34 121.54,20.95 121.54,20.45 124.84,17.14 XB2.16 | v143.38,21.08 143.38,23.62 141.86,23.62 U4.P$16
  Bottom 0.203: v71.12,34.67 80.9,34.67 81.53,35.31 81.53,36.45 90.55,36.45 93.73,33.27 95.12,33.27 95.25,33.15 98.04,33.15 98.42,33.53 101.6,33.53 101.98,33.91 108.33,33.91 108.71,34.29 120.14,34.29 120.52,34.67 123.83,34.67 v124.21,34.29 | v143.38,21.08 142.37,21.08 141.99,21.46 127.51,21.46 126.11,20.07 125.09,20.07 124.46,19.43 124.46,17.65 125.22,17.65 XB2.16
DI0  (via drill 0.4)
  Top 0.203: v22.73,46.74 22.73,46.99 22.23,47.5 IC1.10 | v54.86,37.21 54.61,37.21 54.61,35.94 57.28,33.27 57.28,32 57.66,31.62 57.66,30.1 57.28,29.72 IC2.51
  Bottom 0.203: v22.73,46.74 22.73,47.12 25.65,47.12 27.18,45.59 30.1,45.59 30.48,45.97 32.38,45.97 33.53,44.83 34.04,44.83 34.8,45.59 37.34,45.59 38.48,44.45 43.31,44.45 50.55,37.21 v54.86,37.21
DI1  (via drill 0.4)
  Top 0.203: v35.05,30.73 33.27,30.73 31.24,32.77 31.24,40.89 32.64,42.29 32.64,45.59 26.67,45.59 24.77,47.5 IC1.12 | v55.5,31.5 55.75,31.24 55.75,30.86 56.13,30.48 IC2.50
  Bottom 0.203: v35.05,30.73 35.43,31.11 42.42,31.11 43.18,31.88 55.12,31.88 v55.5,31.5
DI2  (via drill 0.4)
  Top 0.203: v27.43,46.35 27.43,47.37 27.3,47.5 IC1.14 | v42.42,45.97 43.05,45.97 43.05,40.01 42.29,39.24 42.29,36.96 v41.27,35.94 | v56.52,33.02 56.9,33.02 56.9,31.5 IC2.49
  Bottom 0.203: v27.43,46.35 27.81,45.97 29.84,45.97 30.23,46.35 42.04,46.35 v42.42,45.97 | v41.27,35.94 42.42,35.94 43.18,35.18 43.18,32.64 56.13,32.64 v56.52,33.02
DI3  (via drill 0.4)
  Top 0.203: v43.05,46.74 43.43,46.74 43.43,39.75 42.67,38.99 42.67,36.32 43.18,35.81 v43.18,26.42 | v59.69,26.42 60.07,26.42 60.07,30.61 58.67,32 58.67,32.51 IC2.48 | v29.59,46.74 IC1.16
  Bottom 0.203: v43.05,46.74 v29.59,46.74 | v43.18,26.42 43.18,25.78 54.86,25.78 54.99,25.91 56.01,25.91 56.26,26.16 59.44,26.16 v59.69,26.42
DI4  (via drill 0.4)
  Top 0.203: v43.69,38.99 43.69,39.37 43.81,39.5 IC3.10 | v58.29,34.67 59.18,33.78 59.18,33.66 IC2.47
  Bottom 0.203: v43.69,38.99 43.69,36.96 47.24,36.96 47.88,37.59 48.39,37.59 50.93,35.05 56.77,35.05 57.15,34.67 v58.29,34.67
DI5  (via drill 0.4)
  Top 0.203: v46.74,44.07 47.12,44.45 47.12,46.99 46.61,47.5 IC3.12 | v60.07,34.29 60.07,33.66 IC2.46
  Bottom 0.203: v46.74,44.07 46.74,43.81 48.26,43.81 48.64,44.2 48.77,44.2 49.53,44.96 51.18,44.96 60.07,36.07 v60.07,34.29
DI6  (via drill 0.4)
  Top 0.203: v48.51,44.96 48.13,45.34 48.13,46.99 48.64,47.5 IC3.14 | v60.96,35.05 61.34,35.05 61.34,34.04 61.09,33.78 61.09,33.66 IC2.45
  Bottom 0.203: v48.51,44.96 48.51,45.34 58.04,45.34 60.45,42.93 60.45,35.56 v60.96,35.05
DI7
  Top 0.203: IC3.16 51.69,47.5 57.66,41.53 61.72,41.53 61.72,33.66 IC2.44
DO0
  Top 0.203: RN2.4 69.09,36.7 69.34,36.7 69.34,34.04 69.09,33.78 69.09,33.66 IC2.35
DO1
  Top 0.203: RN2.3 67.94,36.45 67.94,36.2 67.69,35.94 67.69,34.04 67.94,33.78 67.94,33.66 IC2.36
DO2
  Top 0.203: RN2.2 67.31,36.45 67.31,33.66 IC2.37
DO3
  Top 0.203: RN2.1 66.67,36.45 66.67,36.32 66.93,36.07 66.93,34.04 66.67,33.78 66.67,33.66 IC2.38
DO4
  Top 0.203: RN1.4 75.31,12.32 74.8,12.32 74.8,7.49 74.17,6.86 74.17,6.35 74.55,5.97 74.55,4.06 73.41,2.92 73.41,2.16 72.14,0.89 68.96,0.89 68.96,3.56 69.47,4.06 69.47,15.49 68.96,16 68.96,16.89 IC2.14
DO5  (via drill 0.4)
  Top 0.203: v76.2,16.13 76.2,13.21 75.82,13.21 RN1.3 | v69.72,16.26 69.72,16.89 IC2.15
  Bottom 0.203: v76.2,16.13 76.07,16.26 v69.72,16.26
DO6  (via drill 0.4)
  Top 0.203: v74.55,14.61 74.55,14.1 75.31,14.1 RN1.2 | v70.48,14.61 70.87,14.61 70.87,17.78 70.74,17.91 IC2.16
  Bottom 0.203: v74.55,14.61 74.55,14.22 70.87,14.22 v70.48,14.61
DO7  (via drill 0.4)
  Top 0.203: v75.44,15.49 75.44,14.86 RN1.1 | v72.52,15.49 72.9,15.49 72.9,19.05 IC2.17
  Bottom 0.203: v75.44,15.49 75.44,15.88 72.9,15.88 v72.52,15.49
DO8  (via drill 0.4)
  Top 0.203: v64.64,14.61 64.64,13.97 65.41,13.97 RN5.2 | v60.96,14.61 60.45,14.61 60.45,16.51 60.71,16.76 60.71,16.89 IC2.4
  Bottom 0.203: v60.96,14.61 v64.64,14.61
DO9  (via drill 0.4)
  Top 0.203: v65.41,15.37 65.41,14.73 RN5.1 | v61.72,15.37 61.72,16.89 IC2.5
  Bottom 0.203: v65.41,15.37 64.39,15.37 64.01,14.99 62.1,14.99 v61.72,15.37
DTR_ZIG  (via drill 0.4)
  Top 0.203: v71.88,35.43 71.88,34.42 71.5,34.04 71.5,32.13 71.37,32 71.37,30.48 71.75,30.48 IC2.31 | v125.73,34.92 125.86,34.8 125.86,28.83 126.75,27.94 126.75,26.16 126.56,25.97 | 126.56,25.97 126.36,25.78 126.36,15.88 127.76,14.48 U4.P$37 | 126.56,25.97 v126.36,26.16
  Bottom 0.203: v71.88,35.43 71.88,35.05 80.64,35.05 81.15,35.56 81.15,36.83 91.95,36.83 92.33,36.45 100.71,36.45 100.84,36.58 106.3,36.58 106.43,36.45 108.33,36.45 109.73,35.05 119.63,35.05 120.02,35.43 124.71,35.43 125.22,34.92 v125.73,34.92 | v126.36,26.16 126.75,26.16 126.75,25.15 126.87,25.02 146.81,25.02 XB2.9
GND  (via drill 0.64, 0.7, 0.9, 1)
  Top 0.457: K3.4 92.46,49.66 92.46,44.07 93.09,43.43 94.87,43.43 RESET.3 | RESET.3 96.77,44.32 97.66,45.21 97.66,49.66 K4.2 98.04,51.44 98.04,52.07 101.09,52.07 101.73,51.44 K4.4 103.12,50.55 v103.89,50.55 | C3.1 83.69,29.72 83.69,27.18 C18.- 84.58,26.42 85.34,26.42 C30.2 87.12,27.18 87.76,27.18 v87.76,27.56 | J10.2 100.97,27.56 100.97,37.97 100.08,38.86 97.54,38.86 97.54,39.37 AVR.6 96.9,40.77 96.9,42.67 96.65,42.93 RESET.3 | v67.06,52.2 66.29,51.44 K1.2 | v70.48,52.2 70.1,52.2 70.1,51.44 K1.4 | v74.93,52.07 74.93,51.94 75.44,51.44 K2.2 | v82.68,50.42 81.92,50.42 K2.4 | v86.87,52.32 86.87,51.44 K3.2 | PWR.C 118.24,37.72 118.24,42.55 116.71,44.07 116.71,44.73 | 148.72,48.77 147.83,47.88 144.61,47.88 | 148.72,48.77 149.35,49.4 149.35,72.52 146.18,72.52 145.16,71.5 C1.- | SPI.2 34.8,35.43 34.8,38.1 35.56,38.86 C29.2 37.08,40.64 37.47,40.64 37.85,41.02 37.85,45.47 39.88,47.5 41.15,47.5 | 44.83,49.4 43.69,49.4 42.8,48.51 IC3.9 42.29,47.5 41.15,47.5 | 44.83,49.4 44.83,48.51 IC3.11 44.83,47.5 44.32,46.99 44.32,39.5 44.58,39.24 44.58,38.99 L2.2 | 46.61,49.28 46.48,49.4 44.83,49.4 | 46.61,49.28 47.37,48.51 IC3.13 | IC3.15 49.91,48.51 49.02,49.4 46.74,49.4 46.61,49.28 | C9.2 59.44,36.45 58.55,36.45 C8.- 56.26,36.2 v55.5,36.2 | L2.2 L4.2 50.29,37.21 50.29,36.83 v50.8,36.32 | 44.7,12.45 44.7,12.83 C17.2 42.93,14.22 42.16,14.22 R28.2 40.89,13.72 39.75,12.57 37.85,12.57 37.85,7.11 37.47,6.73 37.47,4.83 37.85,4.45 37.85,3.94 36.2,2.29 36.07,2.29 | 44.7,12.45 44.7,10.92 49.66,10.92 D9.1 | C45.2 49.66,28.07 48.77,28.07 C19.- | v55.24,20.45 55.24,20.07 56.13,20.07 IC2.63 | v70.99,22.61 70.99,23.24 71.75,23.24 IC2.22
  Top 0.457: IC2.53 56.13,28.07 53.85,28.07 53.85,27.18 52.7,26.04 52.7,23.11 53.21,22.61 53.21,21.84 51.82,20.45 v51.44,20.57 51.44,21.34 C33.2 49.66,22.61 49.28,22.23 | 49.28,22.23 48.26,21.21 48.26,20.83 47.75,20.32 47.75,19.68 C38.2 46.74,19.56 45.34,18.16 45.34,15.49 45.47,15.37 45.47,12.45 44.7,12.45 | C19.- 48.77,27.18 49.15,26.8 49.15,22.35 49.28,22.23 | L2.2 44.32,37.21 43.69,36.58 43.69,27.43 44.32,26.8 46.48,26.8 46.48,27.18 C19.- | C2.1 83.95,18.8 91.06,18.8 92.2,17.65 92.2,11.3 91.57,10.67 91.57,4.95 90.81,4.19 90.81,3.81 K6.4 89.66,2.03 89.66,0.64 87.25,0.64 85.85,2.03 K6.2 84.58,3.81 83.82,4.57 83.82,6.35 80.14,6.35 79.5,5.71 79.5,5.33 77.85,3.68 JOY2.2 | C22.2 42.93,22.73 42.16,22.73 R33.2 40.89,22.73 39.12,22.73 C26.2 37.34,22.86 36.58,22.86 R34.2 35.31,22.86 34.67,22.86 34.67,8.26 36.45,6.48 36.45,4.83 36.07,4.45 36.07,2.29 | R27.2 28.57,13.72 29.46,13.72 C16.2 31.24,13.72 33.4,13.72 33.4,8 32.64,7.24 32.64,6.86 C10.2 31.88,5.08 31.88,3.81 JOY1.2 32,1.91 32,0.64 36.07,0.64 | 66.04,4.06 66.04,5.21 66.55,5.71 C7.- | 66.04,4.06 62.61,0.64 36.07,0.64 | 36.07,2.29 36.07,0.64 | 66.04,4.06 v66.17,3.94 | R14.2 7.49,42.8 9.53,42.8 R13.2 10.79,42.8 11.68,42.8 11.68,46.23 11.94,46.48 11.94,48.51 | RN4.1 27.43,60.45 26.92,60.45 RN4.2 26.67,60.58 26.67,72.01 21.72,72.01 | 21.72,72.01 21.21,72.52 16.64,72.52 | 16.64,72.52 | 11.94,48.51 11.94,50.29 | 11.94,48.51 C21.2 | RN4.6 25.78,59.18 25.4,59.18 RN4.5 25.4,58.8 25.53,58.67 25.53,56.39 v24.64,55.5 | 22.99,49.4 21.84,49.4 20.95,48.51 IC1.9 20.95,47.5 21.84,46.61 21.84,39.24 C4.2 21.34,37.47 21.34,35.94
  Top 0.457: 22.99,49.4 22.99,48.51 IC1.11 | 24.77,49.28 24.64,49.4 22.99,49.4 | 24.77,49.28 25.53,48.51 IC1.13 | 27.69,48.9 27.18,49.4 24.89,49.4 24.77,49.28 | 27.69,48.9 28.07,48.51 IC1.15 | I2C.1 31.75,50.93 29.59,50.93 27.81,49.15 27.81,49.02 27.69,48.9 | 19.81,15.88 19.81,15.37 21.21,13.97 C34.2 | 19.81,15.88 19.81,18.03 IC5.7 19.81,19.3 19.81,24.89 | IC5.26 17.4,26.04 17.78,26.04 IC5.25 17.91,25.4 17.91,25.15 18.16,24.89 19.81,24.89 | 21.08,29.72 21.34,29.97 21.34,35.94 | 21.08,29.72 20.57,29.21 20.57,26.67 IC5.21 20.57,25.4 20.57,24.89 19.81,24.89 | IC5.18 22.48,26.67 22.48,28.19 21.21,29.46 21.21,29.59 21.08,29.72 | v19.68,15.88 19.81,15.88 | 15.24,52.7 15.49,52.7 15.49,45.97 14.61,45.09 14.61,42.04 16.76,39.88 16.76,36.58 17.4,35.94 21.34,35.94 | U4.P$35 127.76,16.38 126.87,16.38 126.87,25.53 127.25,25.91 127.25,26.8 127.76,27.3 C6.- 130.05,27.43 v130.81,27.43 | U4.P$23 134.11,26.29 134.49,26.29 U4.P$22 134.87,26.67 v134.87,28.07 134.87,29.34 C13.2 135.13,31.11 L1.2 | U4.P$9 141.86,16.38 143.26,16.38 C14.2 143.51,15.37 143.51,14.99 142.62,14.1 142.62,12.45 142.75,12.32 142.75,10.54 142.62,10.41 142.62,7.87 143.26,7.24 C11.- 145.54,6.48 149.35,6.48 | v147.7,38.61 147.45,38.61 LED1.C | 149.35,6.48 149.35,25.4 147.96,26.8 XB2.10 | RN3.1 48.13,60.45 47.62,60.45 RN3.2 47.5,60.71 v47.5,61.47 | RN3.6 46.48,59.05 46.1,59.05 RN3.5 45.72,59.31 44.96,59.31 v44.96,59.69 | v21.59,71.88 21.72,72.01 | v41.15,48.01 41.15,47.5 | v148.97,48.64 148.84,48.64 148.72,48.77 | v149.1,0.89 149.35,0.89 149.35,6.48
  Bottom 0.457: RESET.4 101.6,43.05 100.2,41.66 96.14,41.66 95.25,42.55 95.25,42.93 RESET.3 | v87.76,27.56 87.76,27.18 94.36,27.18 94.49,27.05 95.63,27.05 96.39,26.29 98.17,26.29 99.06,27.18 J10.2 | v67.06,52.2 v70.48,52.2 70.74,51.82 71.5,51.05 74.93,51.05 | 74.93,51.05 v74.93,52.07 | 74.93,51.05 78.61,51.05 79.63,50.04 82.68,50.04 v82.68,50.42 82.93,50.04 85.98,50.04 86.11,50.16 86.87,50.16 | 86.87,50.16 v86.87,52.32 | 103.89,50.16 107.31,50.16 v107.7,50.55 | 103.89,50.16 86.87,50.16 | v103.89,50.55 103.89,50.16 | v55.5,36.2 55.5,35.56 51.56,35.56 v50.8,36.32 | v51.44,20.57 55.12,20.57 v55.24,20.45 55.63,20.7 56.64,20.7 58.55,22.61 69.72,22.61 70.1,22.23 70.99,22.23 v70.99,22.61 | v66.17,3.94 66.55,4.32 77.6,4.32 77.6,3.81 JOY2.2 77.6,1.91 77.6,0.64 148.84,0.64 v149.1,0.89 | C31.2 9.4,64.64 7.87,64.64 C28.- 5.59,65.91 5.59,66.8 4.32,66.8 v4.06,66.55 | v24.64,55.5 24.64,54.1 21.21,50.67 20.32,50.67 19.05,49.4 15.62,49.4 14.86,50.16 13.72,50.16 | 13.72,50.16 C32.2 10.54,51.44 v10.54,52.96 | UART.4 v19.68,15.88 | 29.84,48.26 32.13,50.55 I2C.1 | 29.84,48.26 29.59,48.01 21.97,48.01 21.59,48.39 13.72,48.39 13.72,50.16 | 134.87,26.29 v134.87,28.07 | 134.87,26.29 143.76,26.29 144.53,27.05 146.81,27.05 XB2.10 147.96,27.3 149.35,27.3 149.35,36.83 v147.7,38.61 148.84,37.97 148.84,48.64 | v130.81,27.43 130.81,27.05 131.32,27.05 132.08,26.29 134.87,26.29 | 41.15,63.5 36.07,63.5 35.69,63.12 27.56,63.12 26.16,64.52 18.67,64.52 17.27,65.91 C27.2 16.89,67.44 21.46,72.01 | v47.5,61.47 45.97,59.94 45.34,59.94 v44.96,59.69 | 123.83,72.52 123.83,68.45 X5.4 | 123.83,72.52 21.97,72.52 21.46,72.01
  Bottom 0.457: 148.84,48.64 148.84,49.02 149.35,49.53 149.35,72.52 123.83,72.52 | 21.46,72.01 v21.59,71.88 | v41.15,48.01 41.15,47.62 30.48,47.62 29.84,48.26 | 148.84,48.64 v148.97,48.64
  other vias: 61.47,20.83 63.25,20.83 111,12.45 111,10.67 12.19,3.17 14.22,3.17 16.13,3.17 125.48,6.1 125.48,4.32 28.19,40.13 29.72,40.13 2.54,30.48 2.54,33.66 29.21,36.45 29.21,34.92 62.1,27.18 62.1,25.4 67.06,25.4 89.79,40.77 93.47,40.89 18.8,46.86 16,57.4 1.52,71.12 1.52,69.34 16.51,68.83 16.51,70.74 77.09,41.53 77.09,39.88 77.09,36.58 74.17,36.58 73.03,40.39 47.88,12.95 49.28,12.95 26.8,18.67 26.8,17.14 17.78,21.46 22.1,21.46 28.96,8.51 31.11,8.51 14.86,28.19 137.79,28.07 142.62,28.07 122.05,36.96 107.82,18.67 105.41,15.37
  pour Top (isolate 0.254): 132.16,51.2 131.91,51.2 131.91,47.39 124.03,47.39 124.03,50.82 116.67,50.82 116.67,45.62 138.3,45.59 138.3,48.26 144.61,48.28 144.61,43.96 142.37,43.96 138.3,43.94 138.3,44.7 115.53,44.73 113.49,46 107.65,46 107.65,52.22 125.05,52.22 125.31,52.47 125.31,54.12 125.56,54.38 132.16,54.38
  pour Top (isolate 0.254, no thermals): 119.13,43.18 120.78,41.91 125.22,41.91 125.22,41.27 128.65,41.27 128.91,41.53 128.91,43.94 138.3,43.94 138.3,44.96 138.05,45.21 119.13,45.21
  pour Top (isolate 0.254): 0.38,72.64 16.51,72.64 17.53,71.63 17.53,57.28 16,56.13 16,50.29 1.14,50.29 0.25,51.18 0.25,72.52
  pour Top (isolate 0.406, rank 4, hatched): -0.38,73.41 150.5,73.41 150.37,-1.02 -0.51,-1.02
  pour Bottom (isolate 0.61, rank 4, hatched): -1.14,74.3 151.38,74.3 151.38,-2.16 -1.14,-2.16
GPIO0  (via drill 0.4)
  Top 0.203: v60.45,31.24 60.45,25.02 57.28,25.02 IC2.57 | v89.92,31.88 90.17,31.62 90.17,31.24 90.55,30.86 90.55,28.45 v90.17,28.07 | v109.09,25.53 109.09,30.48 108.71,30.86 108.71,31.75 108.46,32 108.46,33.27 107.82,33.91 104.14,33.91 103,32.77 103,28.96 v103.38,28.57
  Bottom 0.203: v60.45,31.24 60.45,30.86 71.5,30.86 72.52,31.88 74.17,31.88 74.55,31.5 89.53,31.5 v89.92,31.88 | v90.17,28.07 90.17,27.69 94.61,27.69 94.74,27.56 J10.1 97.54,28.19 98.3,28.96 103.38,28.96 v103.38,28.57 | v109.09,25.53 109.47,25.91 113.67,25.91 113.92,25.65 119.13,25.65 119.13,27.81 U2.4
GPIO1  (via drill 0.4)
  Top 0.203: v59.08,28.55 58.8,28.27 58.8,26.04 58.04,26.04 58.01,26.01 58.01,25.68 57.3,25.68 IC2.56 | v88.34,28.5 88.54,28.3 88.54,27.23 88.49,27.18 88.49,27.15 88.47,27.15 88.47,27 88.37,27 88.37,26.29 88.16,26.29 88.16,26.24 88.09,26.24 88.09,26.19 87.76,26.19 87.76,25.96 87.73,25.96 87.73,25.93 87.71,25.93 87.71,25.91 87.58,25.91 87.58,25.65 87.43,25.65 v87.43,24.99 | v83.34,22 83.34,21.41 83.13,21.21 82.98,21.21 82.96,21.18 82.96,21.11 82.91,21.11 82.91,20.5 82.47,20.5 v82.47,18.14 | v88.62,17.3 89.56,17.3 v89.94,17.68 | v98.4,19.99 98.4,20.3 98.09,20.3 98.09,20.47 97.99,20.47 97.99,20.57 97.79,20.78 97.79,22.2 J10.5 | v117.91,27.03 117.91,29.72 117.55,30.07 U2.5 | v116.1,26.31 116.1,25.02 v114.68,23.6 | v109.73,22.53 109.32,22.94 109.09,22.94 109.09,23.34 v108.86,23.34
  Bottom 0.203: v59.08,28.55 59.08,28.83 73,28.83 73,26.64 73.53,26.64 73.53,26.29 75.01,26.29 75.01,26.26 75.08,26.26 75.08,26.19 75.26,26.19 75.26,26.01 75.29,26.01 75.29,25.98 75.82,25.98 75.82,25.53 80.09,25.53 80.09,25.91 81.61,25.91 81.61,26.16 85.93,26.16 85.93,27.46 86.26,27.46 86.46,27.66 86.46,28.5 v88.34,28.5 | v87.43,24.99 87.43,21.72 83.24,21.72 83.21,21.74 83.21,22 v83.34,22 | v82.47,18.14 82.47,17.02 88.88,17.02 88.9,17.04 88.9,17.3 v88.62,17.3 | v89.94,17.68 89.94,17.4 91.77,17.4 92.15,17.78 96.19,17.78 97.41,19 97.56,19 98.4,19.84 v98.4,19.99 | v117.91,27.03 117.2,26.31 v116.1,26.31 | v114.68,23.6 114,23.6 114,23.67 112.09,23.67 111.81,23.39 111.81,22.53 v109.73,22.53 | v108.86,23.34 107.97,23.34 107.97,23.67 105.97,23.67 104.52,22.23 102.41,22.23 102.13,22.5 100.74,22.5 100.64,22.4 100.64,22 100.56,22 100.56,21.54 99.26,21.54 98.96,21.84 97.43,21.84 J10.5
GPIO2  (via drill 0.4)
  Top 0.203: v58.42,30.73 58.42,26.42 57.28,26.42 IC2.55 | v90.93,31.5 90.93,26.04 89.41,26.04 89.41,25.91 88.39,25.91 88.39,25.53 v88.27,25.53 | v91.31,25.02 91.69,25.02 91.95,24.77 v91.95,24.13 | v114.55,26.42 113.41,25.27 v113.41,21.72 | v106.3,19.94 106.3,21.72 v105.79,21.72 | v101.85,21.84 101.47,21.46 99.06,21.46 99.06,21.72 98.68,22.1 v98.68,24
  Bottom 0.203: v58.42,30.73 58.42,30.48 71.75,30.48 72.77,31.5 73.91,31.5 74.3,31.11 90.55,31.11 v90.93,31.5 | v88.27,25.53 91.31,25.53 v91.31,25.02 | v91.95,24.13 91.95,23.75 96.27,23.75 96.27,24 96.77,24 96.84,24.07 | 96.84,24.07 97.16,24.38 J10.3 | v114.55,26.42 114.68,26.42 115.82,27.56 U2.6 | v113.41,21.72 109.35,21.72 107.95,20.32 106.68,20.32 v106.3,19.94 | v105.79,21.72 104.65,21.72 104.52,21.84 v101.85,21.84 | v98.68,24 96.9,24 96.84,24.07
GPIO3  (via drill 0.4)
  Top 0.203: v55.5,27.05 56.13,27.05 IC2.54 | v68.71,28.07 v68.71,19.81 | v111.76,18.41 111.76,30.48 111.89,30.61 113.41,30.61 U2.7
  Bottom 0.203: v55.5,27.05 56.01,26.54 58.8,26.54 60.71,28.45 68.33,28.45 v68.71,28.07 | v68.71,19.81 68.71,20.19 70.23,20.19 70.61,20.57 72.14,20.57 72.52,20.95 76.71,20.95 77.22,20.45 80.64,20.45 80.9,20.19 88.14,20.19 89.28,19.05 89.28,17.02 91.95,17.02 92.33,17.4 J10.9 97.79,17.78 98.17,17.78 98.93,18.54 100.08,18.54 101.09,17.53 107.06,17.53 107.31,17.27 111.76,17.27 v111.76,18.41
JOY1-X  (via drill 0.4)
  Top 0.203: v55.5,22.35 55.5,21.84 56.13,21.84 IC2.61 | v33.15,23.37 33.53,23.37 33.53,18.29 31.24,16 C16.1 29.46,15.75 28.57,15.75 R27.1 27.3,14.99 25.91,13.59 25.91,12.57 26.04,12.45 26.04,8.26 26.42,7.87 26.42,6.48 29.08,3.81 JOY1.3
  Bottom 0.203: v55.5,22.35 55.5,22.73 53.34,22.73 52.58,23.5 47.37,23.5 46.99,23.11 44.07,23.11 43.81,23.37 v33.15,23.37
JOY1-Y  (via drill 0.4)
  Top 0.203: v57.91,23.11 57.91,22.61 57.28,22.61 IC2.60 | v46.74,23.88 46.86,23.75 46.86,20.45 44.7,18.29 44.7,17.14 C17.1 42.93,16 42.16,16 R28.1 40.89,15.37 38.48,15.37 37.34,14.22 37.34,7.37 36.96,6.99 v36.96,4.19
  Bottom 0.203: v57.91,23.11 53.59,23.11 52.83,23.88 v46.74,23.88 | v36.96,4.19 34.8,4.19 34.67,4.32 34.16,4.32 33.53,3.68 33.02,3.68 32.51,4.19 24.26,4.19 24.26,3.81 JOY1.5
JOY2-X  (via drill 0.4)
  Top 0.203: v54.74,24.13 54.74,23.5 56.13,23.5 IC2.59 | R33.1 42.16,24.51 42.93,24.51 C22.1 44.7,24.26 v45.34,24.26 46.48,23.11 46.48,20.7 44.32,18.54 44.32,17.78 v43.43,17.78 | v74.93,6.6 74.93,3.81 JOY2.3
  Bottom 0.203: v54.74,24.13 54.74,24.64 45.72,24.64 v45.34,24.26 | v74.93,6.6 74.93,6.22 73.53,6.22 72.77,6.99 72.77,8.13 65.53,8.13 61.98,4.57 59.44,4.57 53.34,10.67 53.34,14.73 50.04,14.73 49.91,14.86 46.74,14.86 43.81,17.78 v43.43,17.78
JOY2-Y  (via drill 0.4)
  Top 0.203: v55.5,24.77 55.5,24.26 56.13,24.26 IC2.58 57.28,23.88 58.8,23.88 59.82,22.86 59.82,19.05 v60.07,18.8 | v40.01,25.02 39.12,25.02 C26.1 37.34,24.64 36.58,24.64 R34.1 | v71.63,17.4 71.25,17.02 71.25,14.35 69.85,12.95 69.85,3.81 JOY2.5
  Bottom 0.203: v55.5,24.77 55.24,25.02 v40.01,25.02 | v71.63,17.4 71.63,17.02 70.61,17.02 69.6,18.03 61.21,18.03 60.45,18.8 v60.07,18.8
JOY_REF  (via drill 0.4)
  Top 0.203: R25.2 52.07,12.7 52.07,10.41 D9.3 51.94,9.65 51.44,9.14 51.44,7.87 51.31,7.75 v51.31,2.41
  Bottom 0.203: 44.07,0.51 70.87,0.51 72.26,1.91 JOY2.4 | 44.07,0.51 26.8,0.51 26.8,1.91 JOY1.4 | v51.31,2.41 51.31,2.79 45.09,2.79 44.07,1.78 44.07,0.51
KCOL-0  (via drill 0.4)
  Top 0.203: v62.48,16.26 62.48,16.89 IC2.6 | v68.71,12.06 69.09,12.06 69.09,4.32 68.58,3.81 68.58,0.64 68.71,0.51 81.28,0.51 v81.28,2.79 | v98.42,2.16 98.55,2.03 98.55,1.4 99.44,0.51 107.82,0.51 107.82,12.45 111.38,16 111.38,17.02 112.52,18.16 112.52,18.67 112.14,19.05 112.14,26.92 v112.52,27.3
  Bottom 0.203: v62.48,16.26 62.36,16.13 61.47,16.13 60.2,14.86 60.2,14.22 60.96,13.46 60.96,12.06 v68.71,12.06 | v81.28,2.79 81.28,2.41 85.98,2.41 86.61,1.78 98.04,1.78 v98.42,2.16 | v112.52,27.3 112.52,26.92 107.82,26.92 107.57,27.18 PTA-KEY.3
KCOL-1  (via drill 0.4)
  Top 0.203: v63.37,12.83 63.37,16.89 IC2.7 | v79.76,13.72 80.52,12.95 80.52,10.29 80.14,9.91 80.14,9.4 80.64,8.89 83.69,8.89 v83.69,9.65 | v107.06,9.02 107.44,9.02 107.44,12.7 111,16.26 111,18.67 111.38,19.05 v111.38,31.11
  Bottom 0.203: v63.37,12.83 63.37,12.45 68.07,12.45 69.47,13.84 74.55,13.84 75.06,13.34 78.49,13.34 78.87,13.72 v79.76,13.72 | v83.69,9.65 83.69,11.94 86.49,11.94 87,11.43 89.53,11.43 89.79,11.68 100.58,11.68 100.71,11.81 101.98,11.81 102.36,11.43 103,11.43 103.38,11.05 105.41,11.05 107.06,9.4 v107.06,9.02 | v111.38,31.11 111.38,29.72 107.57,29.72 PTA-KEY.4
KCOL-2  (via drill 0.4)
  Top 0.203: v62.87,8.13 64.14,9.4 64.14,13.08 63.75,13.46 63.75,16.64 63.88,16.76 63.88,16.89 IC2.8 | v101.47,9.14 104.52,12.19 104.52,15.75 105.66,16.89 105.66,17.91 104.52,19.05 104.52,21.08 105.03,21.59 105.03,25.27 106.05,26.29 108.71,26.29 108.71,30.23 108.33,30.61 108.33,31.5 107.95,31.88 107.95,32.64 PTA-KEY.5
  Bottom 0.203: v62.87,8.13 62.87,8.51 78.23,8.51 78.74,9.02 79.5,9.02 81.53,6.99 81.53,6.22 82.68,6.22 83.31,5.59 83.31,2.79 88.27,2.79 94.23,8.76 99.06,8.76 99.44,9.14 v101.47,9.14
KCOL-3  (via drill 0.4)
  Top 0.203: v64.14,27.69 64.52,27.3 64.52,21.72 64.39,21.59 64.39,21.08 64.77,20.7 64.77,18.03 IC2.9 | v66.42,27.69 66.04,27.69 66.04,30.35 66.8,31.11 67.69,31.11 v67.69,31.62 | v91.06,33.91 92.33,35.18 v92.33,35.69
  Bottom 0.203: v64.14,27.69 64.14,28.07 66.04,28.07 v66.42,27.69 | v67.69,31.62 67.69,31.24 71.25,31.24 72.26,32.26 74.42,32.26 74.8,31.88 88.9,31.88 90.93,33.91 v91.06,33.91 | v92.33,35.69 92.33,36.07 100.97,36.07 101.09,36.2 106.05,36.2 106.17,36.07 PTA-KEY.6
KROW-0  (via drill 0.4)
  Top 0.203: v67.06,47.24 67.44,46.86 67.44,41.53 65.66,41.53 64.52,40.39 64.52,35.69 65.66,34.54 65.66,33.66 IC2.39 | v112.27,36.45 108.84,33.02 108.84,32.26 109.09,32 109.09,31.11 109.47,30.73 109.47,26.16 109.86,25.78 109.86,25.27 107.82,23.24 107.82,23.11 PTA-KEY.1
  Bottom 0.203: v67.06,47.24 67.06,46.86 74.3,46.86 75.56,48.13 76.58,48.13 76.96,47.75 78.99,47.75 79.12,47.88 80.77,47.88 81.03,48.13 87.12,48.13 87.88,47.37 90.04,47.37 90.81,46.61 93.73,46.61 93.85,46.74 97.28,46.74 98.81,48.26 100.33,48.26 101.47,47.12 104.14,47.12 104.9,47.88 105.41,47.88 107.7,45.59 109.09,45.59 110.36,44.32 110.36,36.07 111.89,36.07 v112.27,36.45
KROW-1  (via drill 0.4)